# EAGLE design SparkFun_tDof-TMF8821 (EAGLE 9.6.2)
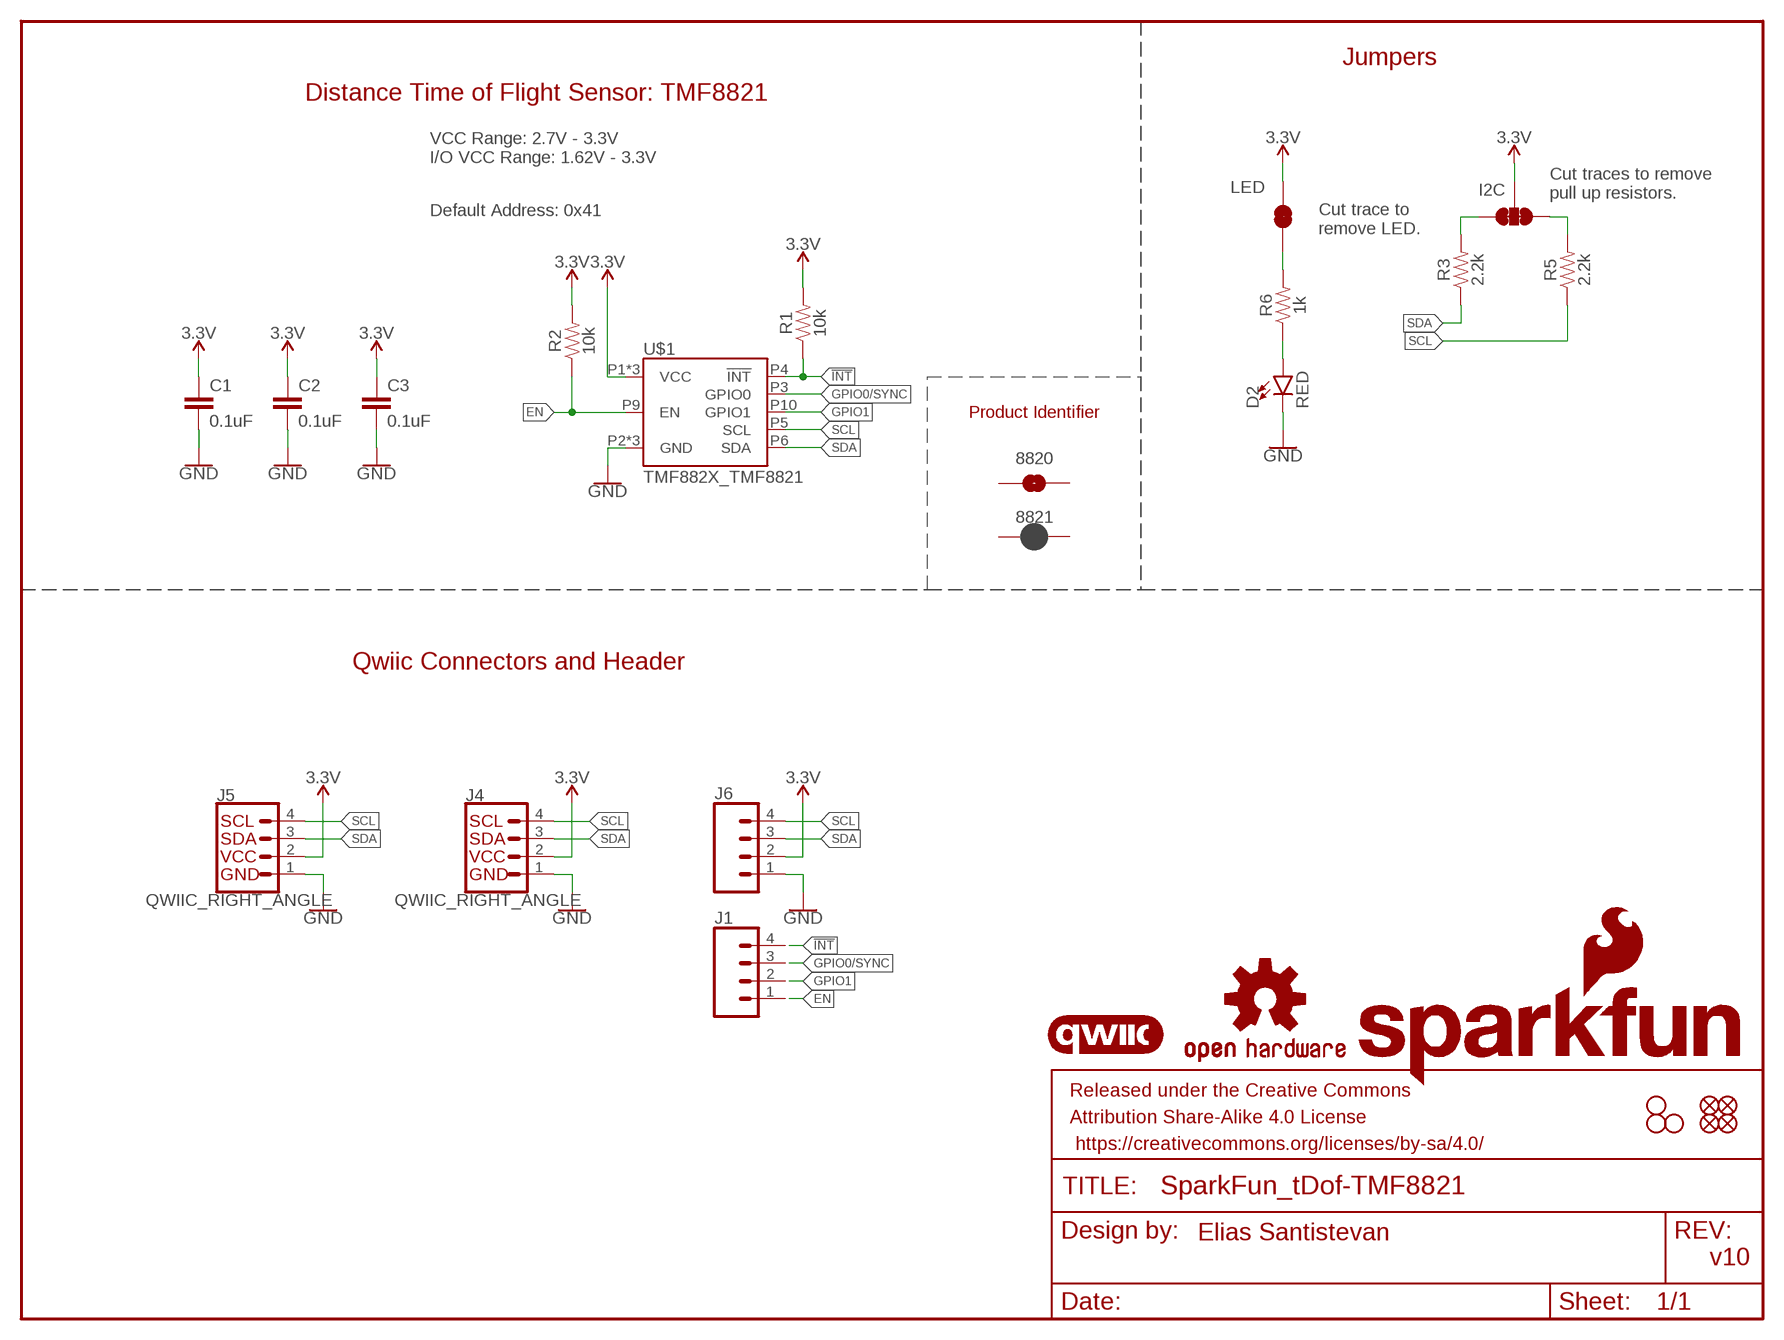
[diagram p0: schematic, sheet 1]

## Parts
8820  JUMPER-SMT_2_NO_SILK  [SMT-JUMPER_2_NO_SILK]
8821  JUMPER-SMT_2_NC_PASTE_SILK  [SMT-JUMPER_2_NC_PASTE_SILK]
C1  0.1uF  0.1UF-0402T-6.3V-10%-X7R  [0402-TIGHT]
C2  0.1uF  0.1UF-0402T-6.3V-10%-X7R  [0402-TIGHT]
C3  0.1uF  0.1UF-0402T-6.3V-10%-X7R  [0402-TIGHT]
D2  RED  LED-RED0603  [LED-0603]
FD5  FIDUCIALUFIDUCIAL  [FIDUCIAL-MICRO]
FD6  FIDUCIALUFIDUCIAL  [FIDUCIAL-MICRO]
FD7  FIDUCIALUFIDUCIAL  [FIDUCIAL-MICRO]
FD8  FIDUCIALUFIDUCIAL  [FIDUCIAL-MICRO]
FRAME2  FRAME-LETTER  [CREATIVE_COMMONS]
H5  STAND-OFFTIGHT  [STAND-OFF-TIGHT]
H6  STAND-OFFTIGHT  [STAND-OFF-TIGHT]
H8  STAND-OFFTIGHT  [STAND-OFF-TIGHT]
I2C  I2C_PU  JUMPER-SMT_3_2-NC_TRACE_SILK  [SMT-JUMPER_3_2-NC_TRACE_SILK]
J1  CONN_041X04_NO_SILK_NO_POP  [1X04_NO_SILK]
J4  QWIIC_RIGHT_ANGLE  QWIIC_CONNECTORJS-1MM  [JST04_1MM_RA]
J5  QWIIC_RIGHT_ANGLE  QWIIC_CONNECTORJS-1MM  [JST04_1MM_RA]
J6  CONN_041X04_NO_SILK  [1X04_NO_SILK]
LED  LED  JUMPER-SMT_2_NC_TRACE_SILK  [SMT-JUMPER_2_NC_TRACE_SILK]
LOGO3  SFE_LOGO_NAME_FLAME.1_INCH  [SFE_LOGO_NAME_FLAME_.1]
LOGO4  OSHW-LOGOS  [OSHW-LOGO-S]
R1  10k  10KOHM-0603-1/10W-1%  [0603]
R2  10k  10KOHM-0603-1/10W-1%  [0603]
R3  2.2k  2.2KOHM-0603-1/10W-1%  [0603]
R5  2.2k  2.2KOHM-0603-1/10W-1%  [0603]
R6  1k  1KOHM-0603-1/10W-1%  [0603]
U$1  TMF882X_TMF8821  [TMF882X]
U$6  QWIIC_LOGO_5MM  [QWIIC_5MM]

## Nets
3.3V: C1.1 C2.1 C3.1 I2C.2 J4.2 J5.2 J6.2 LED.2 R1.2 R2.2 U$1.P1(VCC) U$1.P7(VCC) U$1.P12(VCC)
!INT!: J1.4 R1.1 U$1.P4(!INT!)
EN: J1.1 R2.1 U$1.P9(EN)
GND: C1.2 C2.2 C3.2 D2.C J4.1 J5.1 J6.1 U$1.P2(GND) U$1.P8(GND) U$1.P11(GND)
GPIO0/SYNC: J1.3 U$1.P3(GPIO0)
GPIO1: J1.2 U$1.P10(GPIO1)
N$5: D2.A R6.1
N$6: LED.1 R6.2
N$7: I2C.3 R3.2
N$8: I2C.1 R5.2
SCL: J4.4 J5.4 J6.4 R5.1 U$1.P5(SCL)
SDA: J4.3 J5.3 J6.3 R3.1 U$1.P6(SDA)
Unconnected: 8820.1 8820.2 8821.1 8821.2

## Notes on the sheet
- Jumpers
- Distance Time of Flight Sensor: TMF8821
- VCC Range: 2.7V - 3.3V
  I/O VCC Range: 1.62V - 3.3V
- Cut traces to remove 
  pull up resistors.
- Default Address: 0x41
- Cut trace to 
  remove LED.
- Product Identifier
- Qwiic Connectors and Header
- Elias Santistevan
- v10

## Library data of the parts
8820 = SparkFun-Jumpers:JUMPER-SMT_2_NO: Normally open jumper This jumper has two pads in close proximity to each other. Apply solder to close the connection. Round pads are easier to solder for beginners, but are a lot larger. SparkFun Product that uses the round pads: SparkFun EL Sequencer <https://www.sparkfun.com/products/12781>
8821 = SparkFun-Jumpers:JUMPER-SMT_2_NC_PASTE: Normally closed solder jumper This jumper has an aperture in the stencil to allow solder paste to bridge the split in the wire so it's normally closed (NC). Wick off the solder to open the connection. Reapply solder to reclose the connection.
C1-C3 = SparkFun-Capacitors:0.1UF: 0.1µF ceramic capacitors A capacitor is a passive two-terminal electrical component used to store electrical energy temporarily in an electric field.; PROD_ID: CAP-14993
D2 = SparkFun-LED:LED-RED: Red SMD LED Used in manufacturing of most products at SparkFun Packages: 0603 - SMD 0603 package [Product Link] <http://docs.avagotech.com/docs/AV02-0551EN> 0603 SMART - SMD 0603 SMART package ( more efficient and expensive)[Product Link] <http://www.osram-os.com/Graphics/XPic2/00077099_0.pdf> 1206 - SMD1206 package [Product Link] <https://www.sparkfun.com/datasheets/DevTools/LilyPad/Q150OVS4.pdff> SparkFun Products: Pro Mini 328 -5V <https://www.sparkfun.com/products/821> RedBoard <https://www.sparkfun.com/products/12757> IOIO-OTG <https://www.sparkfun.com/products/13613>; PROD_ID: DIO-00819
FD5-FD8 = SparkFun-Aesthetics:FIDUCIAL: Fiducial Alignment Points Point-of-reference for pick-and-place machines and other optical instruments.
FRAME2 = SparkFun-Aesthetics:FRAME-LETTER: Schematic Frame - Letter Standard 8.5x11 US Letter frame
H5 H6 H8 = SparkFun-Hardware:STAND-OFF: Stand Off Drill holes for mechanically mounting via screws, standoffs, etc. Note: Use the keepout ring to avoid running the screw head into surrounding components. Variant Overviews STAND-OFF - Mechanical footprint for a #4 phillips button head screw. STAND-OFF-TIGHT - Mechanical footprint for a #4 phillips button head screw, Example SparkFun Products Screw - Phillips Head (1/4", 4-40, 10 pack) <https://www.sparkfun.com/products/10453> (PRT-10453) Screw - Phillips Head (1/2", 4-40, 10 pack) <https://www.sparkfun.com/products/10452> (PRT-10452) Screw - Phillips Head (3/4", 4-40, 10 pack) <https://www.sparkfun.com/products/10451> (PRT-10451) Screw - Phillips Head (1", 4-40, 10 pack) <https://www.sparkfun.com/products/10450> (PRT-10450)
I2C = SparkFun-Jumpers:JUMPER-SMT_3_2-NC_TRACE: Normally closed trace jumper (2 of 2 connections) This jumper has a trace between all three pads so they are normally closed (NC). Use a razor knife to open the connection(s). For best results follow the IPC guidelines for cutting traces: Cutout at least 0.063 mm (0.005 in). Remove all loose material to clean up the cut area. Seal the cut with an approved epoxy. Reapply solder to reclose the connection(s).
J1 = SparkFun-Connectors:CONN_04: Multi connection point. Often used as Generic Header-pin footprint for 0.1 inch spaced/style header connections On any of the 0.1 inch spaced packages, you can populate with these: Break Away Headers - Straight <https://www.sparkfun.com/products/116> (PRT-00116) Break Away Male Headers - Right Angle <https://www.sparkfun.com/products/553> (PRT-00553) Female Headers <https://www.sparkfun.com/products/115> (PRT-00115) Break Away Headers - Machine Pin <https://www.sparkfun.com/products/117> (PRT-00117) Break Away Female Headers - Swiss Machine Pin <https://www.sparkfun.com/products/743> (PRT-00743) For SCREWTERMINALS and SPRING TERMINALS visit here: Screw Terimnals on SparkFun.com <https://www.sparkfun.com/search/results?term=Screw+Terminals> (5mm/3.5mm/2.54mm spacing) This device is also useful as a general connection point to wire up your design to another part of your project. Our various solder wires solder well into these plated through hole pads. Hook-Up Wire - Assortment (Stranded, 22 AWG) <https://www.sparkfun.com/products/11375> (PRT-11375) Hook-Up Wire - Assortment (Solid Core, 22 AWG) <https://www.sparkfun.com/products/11367> (PRT-11367) View the entire wire category on our website here <https://www.sparkfun.com/categories/141> Special notes: Molex polarized connector foot print use with SKU : PRT-08231 with associated crimp pins and housings. 1MM SMD Version SKU: PRT-10208
J4 J5 = SparkFun-Connectors:QWIIC_CONNECTOR: SparkFun I2C Standard Qwiic Connector An SMD 1mm pitch JST connector makes it easy and quick (get it? Qwiic?) to connect I2C devices to each other. The Qwiic system <http://www.sparkfun.com/qwiic> enables fast and solderless connection between popular platforms and various sensors and actuators. We carry 200mm <https://www.sparkfun.com/products/14204>, 100mm <https://www.sparkfun.com/products/14205>, 50mm <https://www.sparkfun.com/products/14206>, and breadboard friendly <https://www.sparkfun.com/products/14207> Qwiic cables. We also offer 10 pcs strips <https://www.sparkfun.com/products/14323> the SMD connectors.; PROD_ID: CONN-13694
J6 = SparkFun-Connectors:CONN_04: Multi connection point. Often used as Generic Header-pin footprint for 0.1 inch spaced/style header connections On any of the 0.1 inch spaced packages, you can populate with these: Break Away Headers - Straight <https://www.sparkfun.com/products/116> (PRT-00116) Break Away Male Headers - Right Angle <https://www.sparkfun.com/products/553> (PRT-00553) Female Headers <https://www.sparkfun.com/products/115> (PRT-00115) Break Away Headers - Machine Pin <https://www.sparkfun.com/products/117> (PRT-00117) Break Away Female Headers - Swiss Machine Pin <https://www.sparkfun.com/products/743> (PRT-00743) For SCREWTERMINALS and SPRING TERMINALS visit here: Screw Terimnals on SparkFun.com <https://www.sparkfun.com/search/results?term=Screw+Terminals> (5mm/3.5mm/2.54mm spacing) This device is also useful as a general connection point to wire up your design to another part of your project. Our various solder wires solder well into these plated through hole pads. Hook-Up Wire - Assortment (Stranded, 22 AWG) <https://www.sparkfun.com/products/11375> (PRT-11375) Hook-Up Wire - Assortment (Solid Core, 22 AWG) <https://www.sparkfun.com/products/11367> (PRT-11367) View the entire wire category on our website here <https://www.sparkfun.com/categories/141> Special notes: Molex polarized connector foot print use with SKU : PRT-08231 with associated crimp pins and housings. 1MM SMD Version SKU: PRT-10208; PROD_ID: CONN-09696
LED = SparkFun-Jumpers:JUMPER-SMT_2_NC_TRACE: Normally closed trace jumper This jumper has a trace between two pads so it's normally closed (NC). Use a razor knife to open the connection. For best results follow the IPC guidelines for cutting traces: Cutout at least 0.063 mm (0.005 in). Remove all loose material to clean up the cut area. Seal the cut with an approved epoxy. Reapply solder to reclose the connection.
LOGO3 = SparkFun-Aesthetics:SFE_LOGO_NAME_FLAME: SparkFun Font Logo w/ Flame This is the SparkFun full logo. The logo on the schematic will always be the same size; the package variant is the height of the flame part of the logo. Default layer for the logo on the board is tSilk.
LOGO4 = SparkFun-Aesthetics:OSHW-LOGO: Open-Source Hardware (OSHW) Logo This logo indicates the piece of hardware it is found on incorporates a OSHW license and/or adheres to the definition of open source hardware found here: http://freedomdefined.org/OSHW
R1 R2 = SparkFun-Resistors:10KOHM: 10kΩ resistor A resistor is a passive two-terminal electrical component that implements electrical resistance as a circuit element. Resistors act to reduce current flow, and, at the same time, act to lower voltage levels within circuits. - Wikipedia; PROD_ID: RES-00824
R3 R5 = SparkFun-Resistors:2.2KOHM: 2.2kΩ resistor A resistor is a passive two-terminal electrical component that implements electrical resistance as a circuit element. Resistors act to reduce current flow, and, at the same time, act to lower voltage levels within circuits. - Wikipedia; PROD_ID: RES-08272
R6 = SparkFun-Resistors:1KOHM: 1kΩ resistor A resistor is a passive two-terminal electrical component that implements electrical resistance as a circuit element. Resistors act to reduce current flow, and, at the same time, act to lower voltage levels within circuits. - Wikipedia; PROD_ID: RES-07856
U$1 = TMF882X:TMF882X; PROD_ID: IC-16433
U$6 = SparkFun-Aesthetics:QWIIC_LOGO: Qwiic Logos for placement on schematic and PCB. The 5.5mm silk logo is best for placing next to Qwiic connector.

## Board
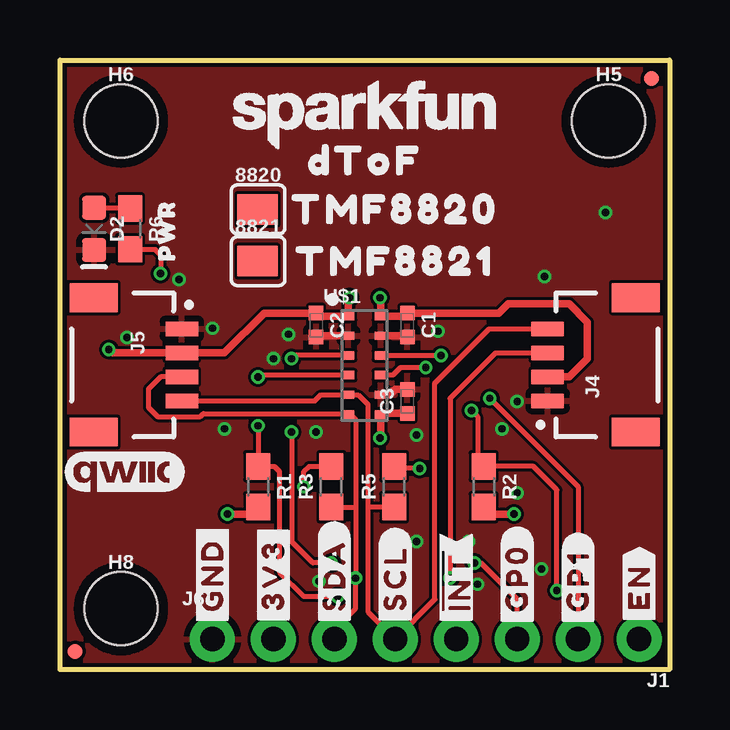
[diagram p1: board, top side]
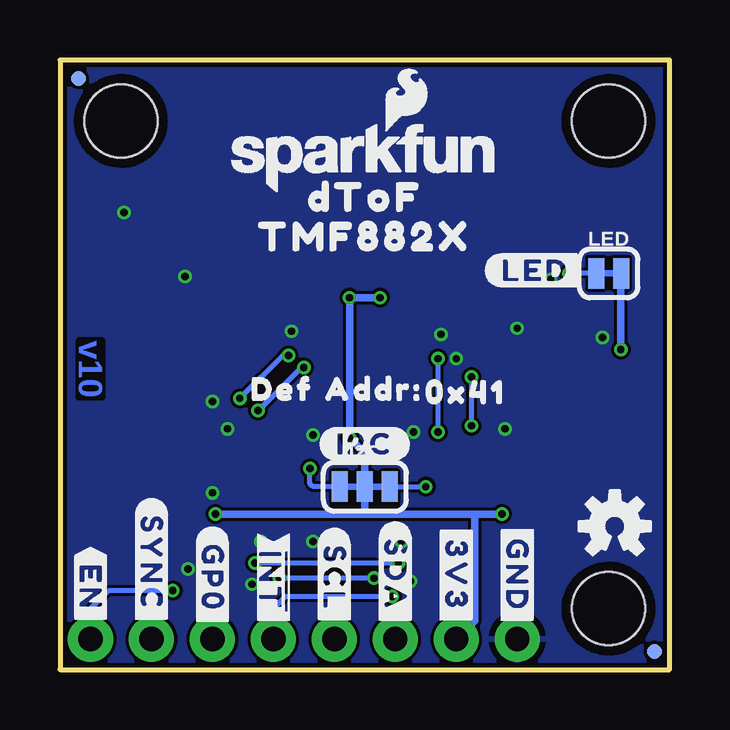
[diagram p2: board, bottom side, seen from below]

Size 25.4 x 25.4 mm. Coordinates in mm from the lower left corner, seen from the top.
Outline: 0,0 0,25.4 25.4,25.4 25.4,0 0,0
Copper layers (1*16): Top 0.035mm / dielectric 1.5mm / Bottom 0.035mm
Design rules "SparkFun-2-Layer-Minimum-JLCPCB": minimum track width 5mil, minimum drill 0.3mm, track to track 5mil, track to pad 5mil, pad to pad 5mil, via to via 5mil, smd to smd 5mil, copper to edge 7mil, drill to drill 7mil, minimum pad ring 5mil, minimum via ring 5mil, stop-mask expansion 2.5mil, vias tented up to drill 25mil, thermal gap 10mil

### Footprints (pad centres in the part's own frame; a part is rotated, then mirrored left to right if it is on the bottom)
PRODUCT_IDENT_NO_SILK = smd 1.676 x 1.27: 1 -0.025,0
PRODUCT_IDENT_PASTE_SILK = smd 1.676 x 1.27: 1 -0.025,0
0402-TIGHT = smd 0.6 x 0.6: 1 -0.5,0; 2 0.5,0
LED-0603 = smd 1 x 1: A -0.877,0; C 0.877,0
FIDUCIAL-MICRO = smd 0.635 x 0.635: 1 0,0
STAND-OFF-TIGHT = hole 3.048: 0,0
SMT-JUMPER_3_2-NC_TRACE_SILK = smd 0.66 x 1.27: 1 -1.041,0; 2 0,0; 3 1.041,0
1X04_NO_SILK = drill 1.016 pad 1.88: 1 0,0; 2 2.54,0; 3 5.08,0; 4 7.62,0
JST04_1MM_RA = smd 0.6 x 1.35: 1 -1.5,0; 2 -0.5,0; 3 0.5,0; 4 1.5,0 | smd 1.2 x 2: NC1 2.8,-3.675; NC2 -2.8,-3.675
SMT-JUMPER_2_NC_TRACE_SILK = smd 0.66 x 1.27: 1 -0.521,0; 2 0.521,0
0603 = smd 1.1 x 1: 1 -0.85,0; 2 0.85,0
TMF882X = smd 0.5 x 0.35: P1 -0.686,2.032; P2 -0.686,1.212; P3 -0.686,0.392; P4 -0.686,-0.428; P5 -0.686,-1.248; P6 -0.686,-2.068; P7 0.664,-2.068; P8 0.664,-1.248; P9 0.664,-0.428; P10 0.664,0.392; P11 0.664,1.212; P12 0.664,2.032

### Placement (x,y rotation side)
8820  PROD_ID_NO-PASTE_SILK  [PRODUCT_IDENT_NO_SILK]  8.26,19.18 0 top
8821  PROD_ID_PASTE_SILK  [PRODUCT_IDENT_PASTE_SILK]  8.26,17.02 0 top
C1  14.48,14.35 270 top
C2  10.67,14.35 270 top
C3  14.48,11.18 90 top
D2  1.42,18.36 270 top
FD5  0.64,0.76 0 bottom
FD6  24.64,24.64 0 bottom
FD7  24.64,24.64 0 top
FD8  0.64,0.76 0 top
FRAME2  -11.94,-16.76 0 top  (outside the outline)
H5  22.86,22.86 0 top
H6  2.54,22.86 0 top
H8  2.54,2.54 0 top
I2C  12.7,7.62 0 bottom
J1  24.13,1.27 180 top
J4  20.32,12.7 90 top
J5  5.08,12.7 270 top
J6  6.35,1.27 0 top
LED  2.54,16.51 0 bottom
LOGO3  12.7,21.34 0 bottom
LOGO4  2.29,5.97 0 bottom
R1  8.26,7.62 270 top
R2  17.65,7.62 270 top
R3  11.3,7.62 90 top
R5  13.92,7.62 90 top
R6  2.92,18.36 270 top
U$1  12.7,12.7 0 top
U$2  [#3V3#0]  8.89,3.94 90 top
U$3  [#GND#4]  6.35,3.94 90 top
U$4  [#SDA#6]  11.43,3.94 90 top
U$5  [#SCL#5]  13.97,3.81 90 top
U$6  2.67,8.26 0 top
U$7  [#EN#7]  24.13,3.43 270 bottom
U$8  [#GP0#19]  19.05,3.81 90 top
U$9  [#GP1#8]  21.59,3.68 90 top
U$10  [##INT##9]  16.51,3.68 90 top
U$11  [DTOF882188211]  12.7,21.21 0 top
U$12  [TMF88209]  13.97,19.18 0 top
U$13  [SFE_LOGO_NAME_.1]  12.7,23.11 0 top
U$14  [PWR882188212]  4.45,18.29 90 top
U$15  [#SYNC#8]  21.59,4.45 270 bottom
U$16  [#3V3#0]  8.89,3.94 270 bottom
U$17  [#EN#7]  24.13,3.43 90 top
U$18  [#GND#4]  6.35,3.94 270 bottom
U$19  [#GP0#8]  19.05,3.81 270 bottom
U$20  [#I2C#11]  12.7,9.4 0 bottom
U$21  [#SCL#5]  13.97,3.81 270 bottom
U$22  [#LED#10]  5.59,16.64 0 bottom
U$23  [#SDA#6]  11.43,3.94 270 bottom
U$24  [##INT##8]  16.51,3.68 270 bottom
U$25  [TMF882188210]  13.97,17.02 0 top
U$26  [DTOF882188211]  12.7,19.68 0 bottom
U$27  [TMF882X882188211]  12.7,18.03 0 bottom
U$28  [DEF11]  16.13,11.68 0 bottom
U$29  [ADDR#12]  12.32,11.68 0 bottom
U$30  [0X4113]  8.51,11.56 0 bottom

### Tracks (layer width: path | path; a pad name or v marks a point on that pad's centre or on a via)
3.3V  (via drill 0.3)
  Top 0.305: v2.03,13.34 2.17,13.2 J5.2 6.85,13.2 8.5,14.85 C2.1 10.79,14.73 U$1.P1 12.01,15.44 v12.06,15.49 | J4.2 21.21,12.19 21.97,12.95 21.97,14.48 21.21,15.24 18.68,15.24 18.29,14.85 C1.1 14.36,14.73 U$1.P12 13.36,15.46 v13.34,15.49 | R1.2 7.96,6.48 v6.99,6.48 | C3.1 13.41,10.68 U$1.P7 13.36,9.68 v13.34,9.65 | v18.92,6.48 17.95,6.48 R2.2
  Bottom 0.305: LED.2 2.03,16.5 v2.03,13.34 | v6.99,6.48 8.13,6.48 | v12.06,15.49 v13.34,15.49 v13.34,9.65 12.7,9.02 I2C.2 12.7,6.48 | J6.2 8.13,2.03 8.13,6.48 | 8.13,6.48 12.7,6.48 | 12.7,6.48 v18.92,6.48
!INT!  (via drill 0.3)
  Top 0.203: U$1.P4 8.34,12.27 v8.26,12.19 | v8.26,10.16 R1.1 8.93,8.47 9.14,8.26 9.14,4.06 10.16,3.05 v11.56,3.05
  Bottom 0.203: v8.26,12.19 v8.26,10.16 | J1.4 16.51,2.54 16,3.05 v11.56,3.05
EN  (via drill 0.3)
  Top 0.203: v20.7,3.3 20.7,7.49 19.72,8.47 R2.1 17.4,8.72 17.4,10.54 v17.14,10.79 | v15.24,12.58 14.18,12.58 13.87,12.27 U$1.P9
  Bottom 0.203: J1.1 24.13,2.54 23.37,3.3 v20.7,3.3 | v17.14,10.79 15.36,12.58 v15.24,12.58
GND  (via drill 0.3)
  Top 0.305: U$1.P8 13.74,11.45 13.97,11.68 C3.2 | U$1.P11 14.42,13.91 C1.2 | U$1.P2 10.73,13.91 C2.2
  other vias: 6.35,14.22 20.19,16.38 22.73,19.05 4.95,16.26 9.53,13.97 8.89,12.95 6.86,10.03 10.67,9.91 15.75,14.1 18.41,10.03 14.86,9.78 17.4,3.56 10.79,3.68 2.79,13.84 19.05,11.18 20.07,4.19 19.05,7.37 17.02,5.33 14.86,5.33 11.18,5.33
  pour Top: 0,25.4 25.4,25.4 25.4,0 0,0
  pour Bottom: 0,25.4 25.4,25.4 25.4,0 0,0
GPIO0/SYNC  (via drill 0.3)
  Top 0.203: U$1.P3 9.79,13.09 v9.65,12.95 | J1.3 19.05,2.92 17.53,4.45 v17.27,4.45 | v11.3,4.45 10.54,4.45 9.65,5.33 v9.65,9.91
  Bottom 0.203: v9.65,12.95 v9.65,9.91 | v17.27,4.45 v11.3,4.45
GPIO1  (via drill 0.3)
  Top 0.203: U$1.P10 15.86,13.09 v15.88,13.08 | v17.91,11.3 21.59,7.62 J1.2
  Bottom 0.203: v15.88,13.08 16.13,13.08 v17.91,11.3
N$5
  Top 0.203: D2.A 2.89,19.24 R6.1
N$6  (via drill 0.3)
  Top 0.203: R6.2 3.95,17.51 4.19,17.27 v4.19,16.51
  Bottom 0.203: LED.1 v4.19,16.51
N$7  (via drill 0.3)
  Top 0.203: v10.16,7.62 10.16,8.26 10.38,8.47 R3.2
  Bottom 0.203: I2C.3 v10.16,7.62
N$8  (via drill 0.3)
  Top 0.203: v14.99,8.38 14.01,8.38 R5.2
  Bottom 0.203: I2C.1 14.86,7.62 14.99,7.75 v14.99,8.38
SCL
  Top 0.203: J5.4 10.62,11.2 10.87,11.45 U$1.P5 12.42,11.45 12.83,11.05 12.83,6.77 | R5.1 12.83,6.77 | 12.83,6.77 12.83,2.41 J6.4 15.62,2.92 15.62,11.94 17.88,14.2 J4.4
SDA  (via drill 0.3)
  Top 0.203: J5.3 4.2,12.2 3.68,11.68 3.68,10.92 4.06,10.54 5.84,10.54 5.97,10.67 11.98,10.67 U$1.P6 12.1,10.63 12.32,10.41 12.32,6.73 | R3.1 12.28,6.77 12.32,6.73 | v16.26,3.81 16.26,11.3 18.15,13.2 J4.3 | 12.32,6.73 v12.32,3.81 12.32,2.54 11.43,1.65 J6.3
  Bottom 0.203: v12.32,3.81 v16.26,3.81

### Text on the board
Bottom: v10
Measures: Units in Inches
tDocu: Elias Santistevan